# EAGLE design small_mavric (EAGLE 6.2)
DISTRIBUTOR: Mouser

## Sheet 1 of 4
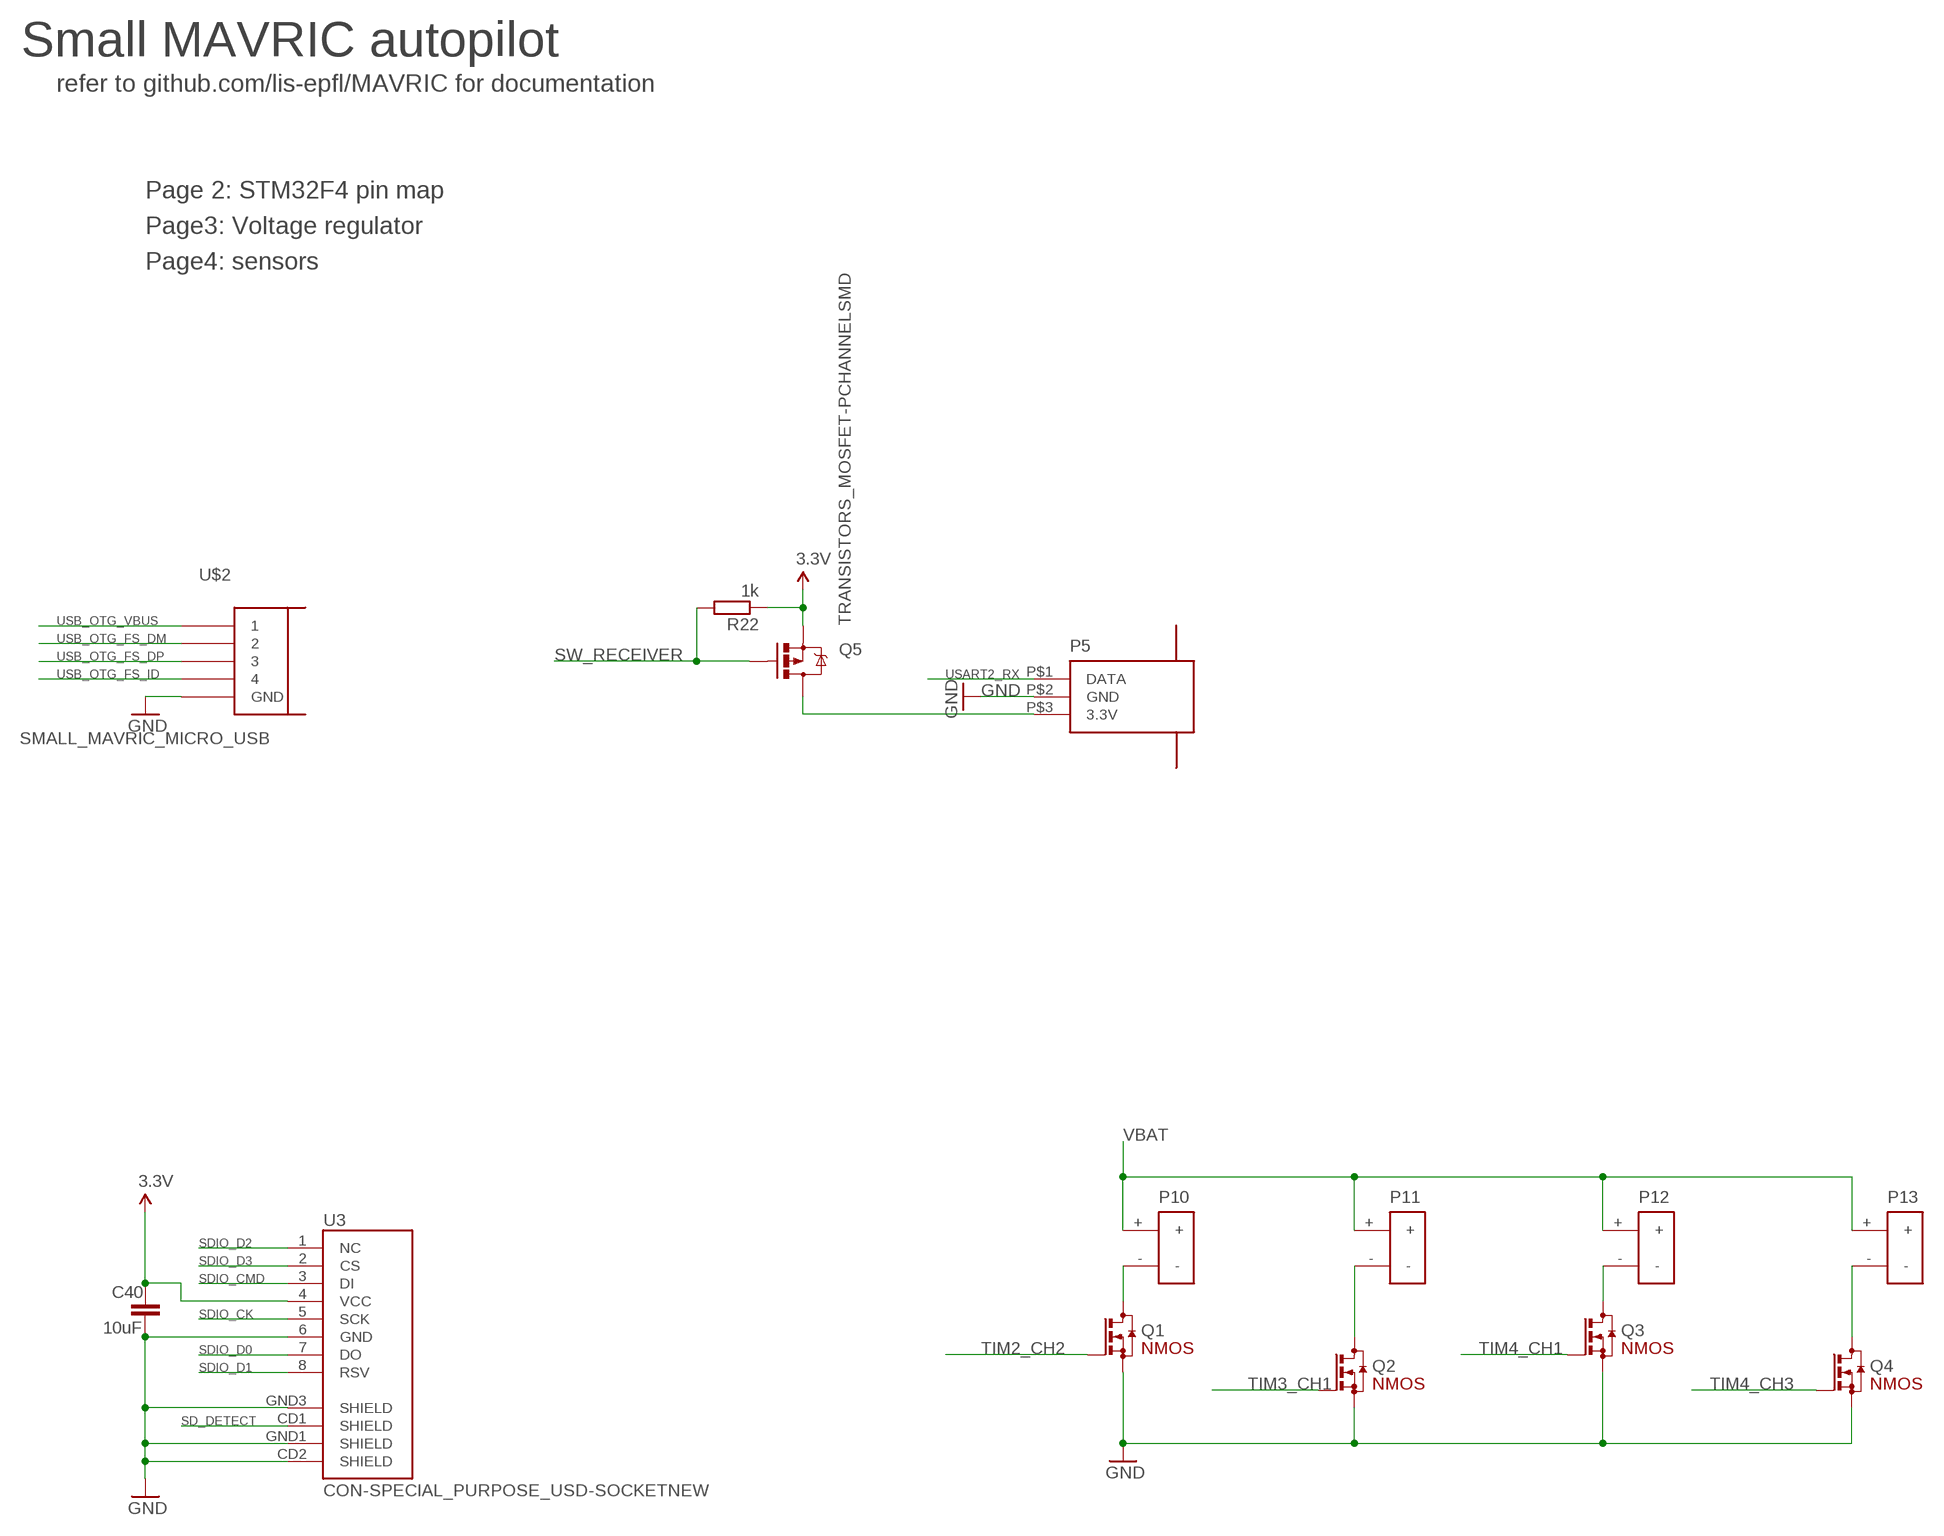
[diagram p0: schematic, sheet 1]

### Parts
C40  10uF  SMALL_MAVRIC_CAPACITOR_C0603  [SMALL_MAVRIC_SMALL_MAVRIC_CAPACITOR_C0603]
P5  CON-SPECIAL_PURPOSE_SPEKTRUM_RECEIVER  [CON-SPECIAL_PURPOSE_JST_1.5MM_3WAY]
P10  POWERSMALL_SMD  [POWER_SMALL_SMD]
P11  POWERSMALL_SMD  [POWER_SMALL_SMD]
P12  POWERSMALL_SMD  [POWER_SMALL_SMD]
P13  POWERSMALL_SMD  [POWER_SMALL_SMD]
Q1  N-CHANNEL_SOT23  [SOT23]
Q2  N-CHANNEL_SOT23  [SOT23]
Q3  N-CHANNEL_SOT23  [SOT23]
Q4  N-CHANNEL_SOT23  [SOT23]
Q5  TRANSISTORS_MOSFET-PCHANNELSMD  [TRANSISTORS_SOT23-3]
R22  1k  SMALL_MAVRIC_RESISTOR_R0402  [SMALL_MAVRIC_SMALL_MAVRIC_RESISTOR_R0402]
U3  CON-SPECIAL_PURPOSE_USD-SOCKETNEW  [CON-SPECIAL_PURPOSE_MICRO-SD-SOCKET-PP]
U$2  SMALL_MAVRIC_MICRO_USB  [SMALL_MAVRIC_MICR0_USB]

### Nets
3.3V [power]: C40.1 Q5.2(S) R22.1 U3.4(VCC) ; also sheet 2,3,4
GND [power]: C40.2 P5.P$2(GND) Q1.2(S) Q2.2(S) Q3.2(S) Q4.2(S) U3.6(GND) U3.CD2(SHIELD) U3.GND1(SHIELD) U3.GND3(SHIELD) U$2.5(GND) ; also sheet 2,3,4
N$10 [power]: P11.- Q2.3(D)
N$12 [power]: P12.- Q3.3(D)
N$22 [power]: P10.- Q1.3(D)
N$26 [power]: P13.- Q4.3(D)
N$34 [more_power]: P5.P$3(3.3V) Q5.3(D)
SD_DETECT: U3.CD1(SHIELD) ; also sheet 2
SDIO_CK: U3.5(SCK) ; also sheet 2
SDIO_CMD: U3.3(DI) ; also sheet 2
SDIO_D0: U3.7(DO) ; also sheet 2
SDIO_D1: U3.8(RSV) ; also sheet 2
SDIO_D2: U3.1(NC) ; also sheet 2
SDIO_D3: U3.2(CS) ; also sheet 2
SW_RECEIVER: Q5.1(G) R22.2 ; also sheet 2
TIM2_CH2: Q1.1(G) ; also sheet 2
TIM3_CH1: Q2.1(G) ; also sheet 2
TIM4_CH1: Q3.1(G) ; also sheet 2
TIM4_CH3: Q4.1(G) ; also sheet 2
USART2_RX: P5.P$1(DATA) ; also sheet 2
USB_OTG_FS_DM: U$2.2 ; also sheet 2
USB_OTG_FS_DP: U$2.3 ; also sheet 2
USB_OTG_FS_ID: U$2.4 ; also sheet 2
USB_OTG_VBUS [power]: U$2.1 ; also sheet 2,3
VBAT [more_power]: P10.+ P11.+ P12.+ P13.+ ; also sheet 3

### Notes on the sheet
- Small MAVRIC autopilot
- refer to github.com/lis-epfl/MAVRIC for documentation
- Page 2: STM32F4 pin map
- Page3: Voltage regulator
- Page4: sensors

## Sheet 2 of 4
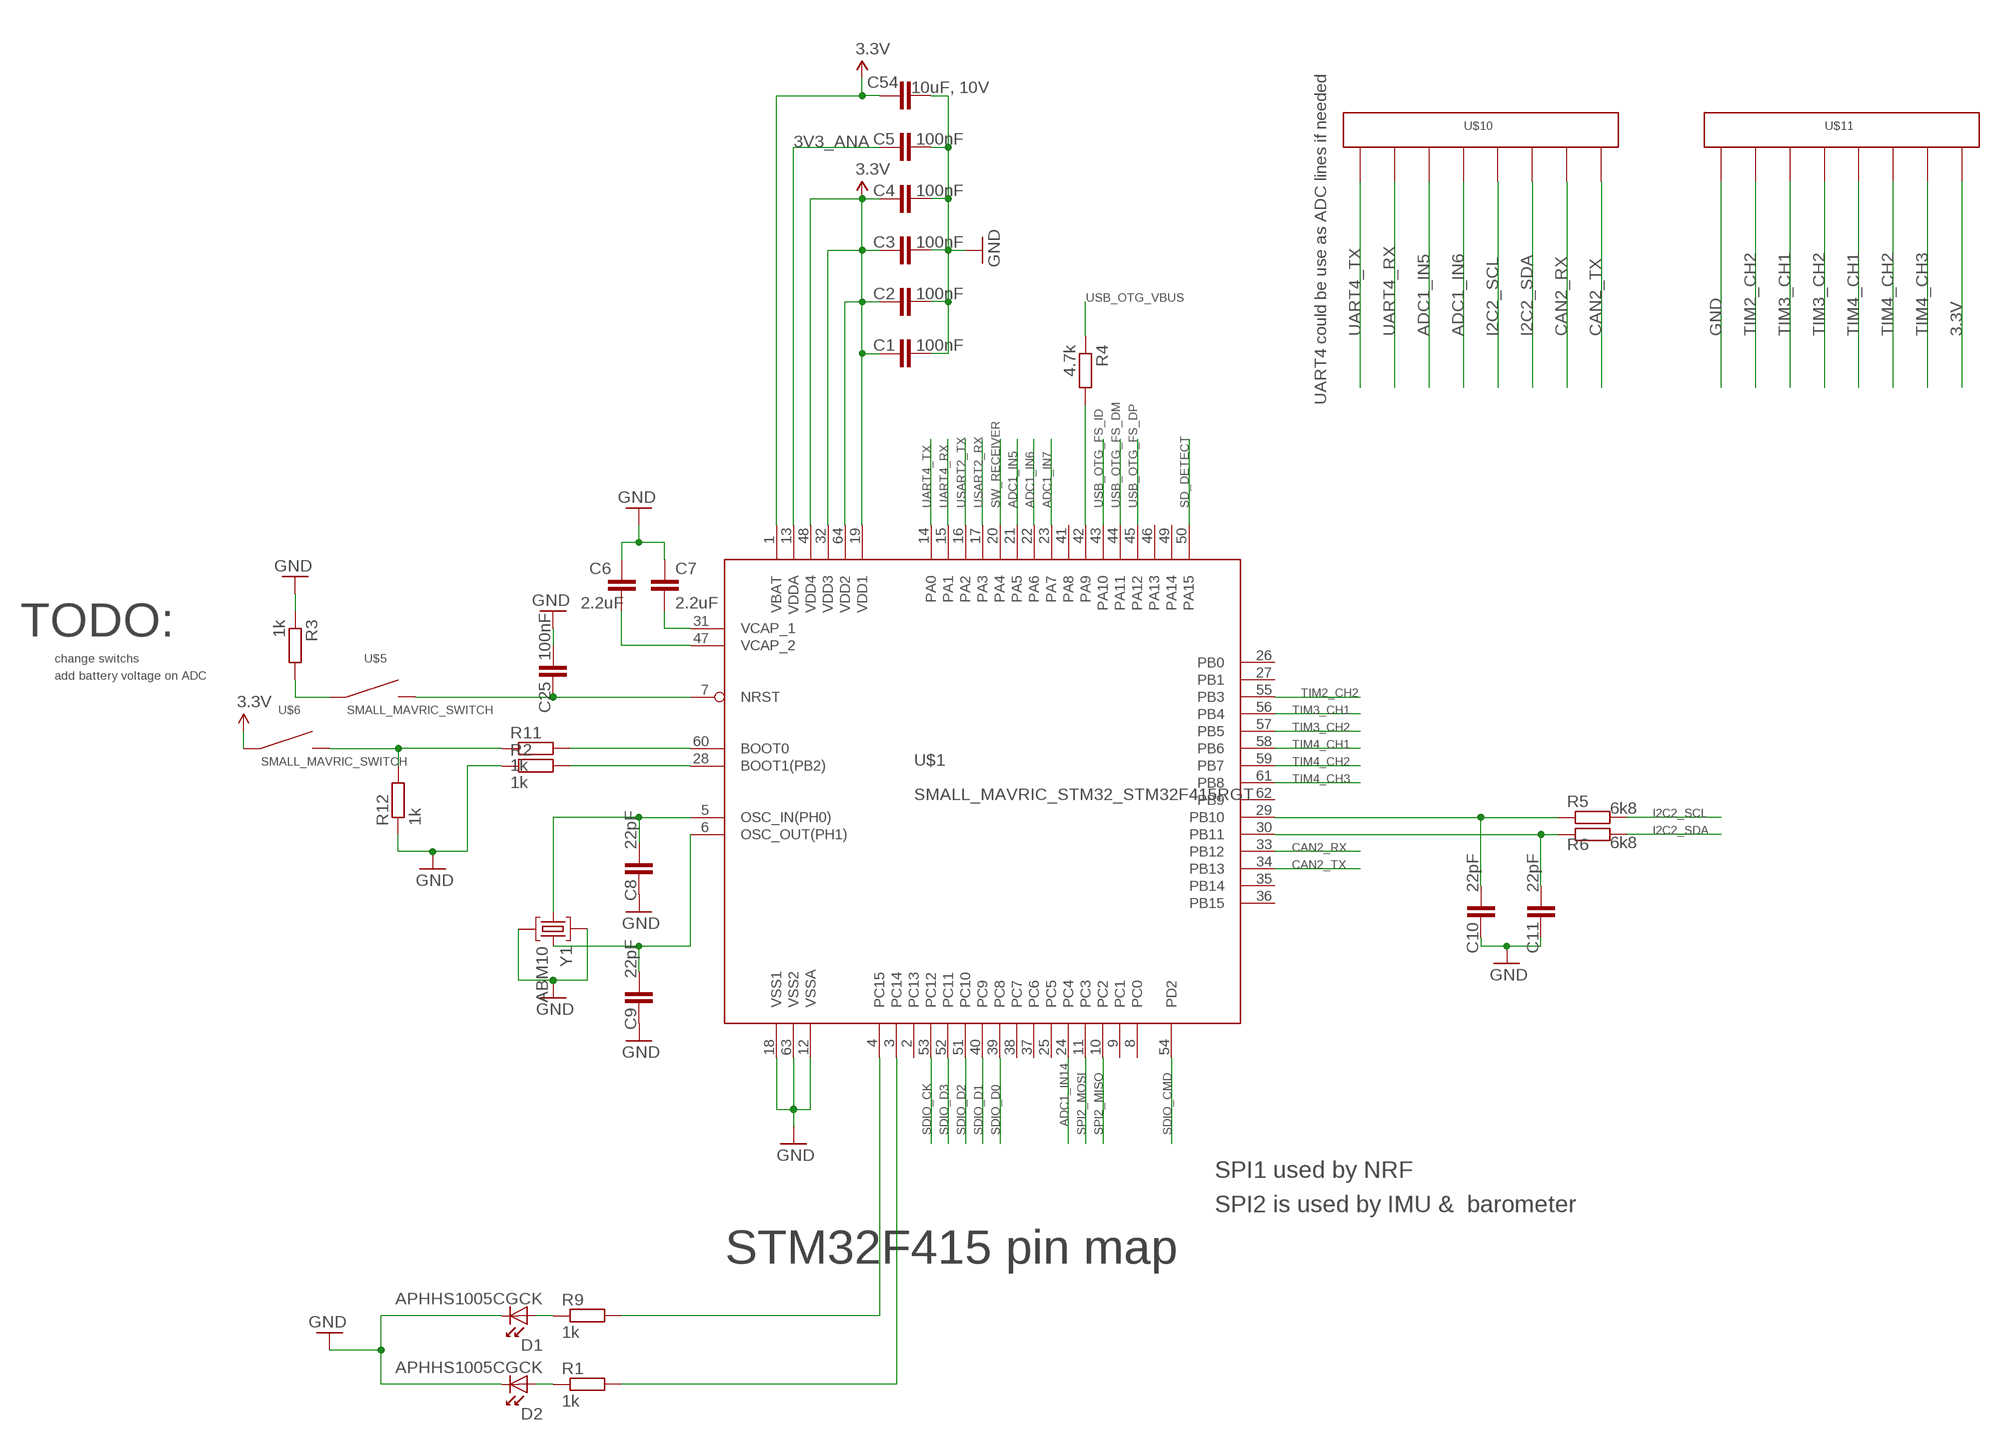
[diagram p1: schematic, sheet 2]

### Parts
C1  100nF  SMALL_MAVRIC_CAPACITOR_C0402  [SMALL_MAVRIC_SMALL_MAVRIC_CAPACITOR_C0402]
C2  100nF  SMALL_MAVRIC_CAPACITOR_C0402  [SMALL_MAVRIC_SMALL_MAVRIC_CAPACITOR_C0402]
C3  100nF  SMALL_MAVRIC_CAPACITOR_C0402  [SMALL_MAVRIC_SMALL_MAVRIC_CAPACITOR_C0402]
C4  100nF  SMALL_MAVRIC_CAPACITOR_C0402  [SMALL_MAVRIC_SMALL_MAVRIC_CAPACITOR_C0402]
C5  100nF  SMALL_MAVRIC_CAPACITOR_C0402  [SMALL_MAVRIC_SMALL_MAVRIC_CAPACITOR_C0402]
C6  2.2uF  SMALL_MAVRIC_CAPACITOR_C0603  [SMALL_MAVRIC_SMALL_MAVRIC_CAPACITOR_C0603]
C7  2.2uF  SMALL_MAVRIC_CAPACITOR_C0603  [SMALL_MAVRIC_SMALL_MAVRIC_CAPACITOR_C0603]
C8  22pF  SMALL_MAVRIC_CAPACITOR_C0402  [SMALL_MAVRIC_SMALL_MAVRIC_CAPACITOR_C0402]
C9  22pF  SMALL_MAVRIC_CAPACITOR_C0402  [SMALL_MAVRIC_SMALL_MAVRIC_CAPACITOR_C0402]
C10  22pF  SMALL_MAVRIC_CAPACITOR_C0402  [SMALL_MAVRIC_SMALL_MAVRIC_CAPACITOR_C0402]
C11  22pF  SMALL_MAVRIC_CAPACITOR_C0402  [SMALL_MAVRIC_SMALL_MAVRIC_CAPACITOR_C0402]
C25  100nF  SMALL_MAVRIC_CAPACITOR_C0402  [SMALL_MAVRIC_SMALL_MAVRIC_CAPACITOR_C0402]
C54  10uF, 10V  SMALL_MAVRIC_CAPACITOR_C0603  [SMALL_MAVRIC_SMALL_MAVRIC_CAPACITOR_C0603]
D1  APHHS1005CGCK  COMMON_LED  [LED_0402]
D2  APHHS1005CGCK  COMMON_LED  [LED_0402]
R1  1k  SMALL_MAVRIC_RESISTOR_R0402  [SMALL_MAVRIC_SMALL_MAVRIC_RESISTOR_R0402]
R2  1k  SMALL_MAVRIC_RESISTOR_R0402  [SMALL_MAVRIC_SMALL_MAVRIC_RESISTOR_R0402]
R3  1k  SMALL_MAVRIC_RESISTOR_R0402  [SMALL_MAVRIC_SMALL_MAVRIC_RESISTOR_R0402]
R4  4.7k  SMALL_MAVRIC_RESISTOR_R0402  [SMALL_MAVRIC_SMALL_MAVRIC_RESISTOR_R0402]
R5  6k8  SMALL_MAVRIC_RESISTOR_R0402  [SMALL_MAVRIC_SMALL_MAVRIC_RESISTOR_R0402]
R6  6k8  SMALL_MAVRIC_RESISTOR_R0402  [SMALL_MAVRIC_SMALL_MAVRIC_RESISTOR_R0402]
R9  1k  SMALL_MAVRIC_RESISTOR_R0402  [SMALL_MAVRIC_SMALL_MAVRIC_RESISTOR_R0402]
R11  1k  SMALL_MAVRIC_RESISTOR_R0402  [SMALL_MAVRIC_SMALL_MAVRIC_RESISTOR_R0402]
R12  1k  SMALL_MAVRIC_RESISTOR_R0402  [SMALL_MAVRIC_SMALL_MAVRIC_RESISTOR_R0402]
U$1  SMALL_MAVRIC_STM32_STM32F415RGT  [SMALL_MAVRIC_STM32_LQFP64]
U$5  SMALL_MAVRIC_SWITCH  [SMALL_MAVRIC_SWITCH]
U$6  SMALL_MAVRIC_SWITCH  [SMALL_MAVRIC_SWITCH]
U$10  SMALL_MAVRIC_CONN_RAIL_X8  [SMALL_MAVRIC_CONN_RAIL_X8]
U$11  SMALL_MAVRIC_CONN_RAIL_X8  [SMALL_MAVRIC_CONN_RAIL_X8]
Y1  ABM10  [OSCILLATOR_ABM10]

### Nets
3.3V [power]: C1.1 C2.1 C3.1 C4.1 C54.1 U$1.1(VBAT) U$1.19(VDD1) U$1.32(VDD3) U$1.48(VDD4) U$1.64(VDD2) U$6.1 U$11.P$8 ; also sheet 1,3,4
3V3_ANA: C5.1 U$1.13(VDDA) ; also sheet 3,4
ADC1_IN5: U$1.21(PA5) U$10.P$3
ADC1_IN6: U$1.22(PA6) U$10.P$4
ADC1_IN7: U$1.23(PA7)
ADC1_IN14: U$1.24(PC4)
CAN2_RX: U$1.33(PB12) U$10.P$7
CAN2_TX: U$1.34(PB13) U$10.P$8
GND [power]: C1.2 C2.2 C3.2 C4.2 C5.2 C6.1 C7.1 C8.1 C9.1 C10.1 C11.1 C25.2 C54.2 D1.C D2.C R2.1 R3.1 R12.1 U$1.12(VSSA) U$1.18(VSS1) U$1.63(VSS2) U$11.P$1 Y1.2 Y1.4 ; also sheet 1,3,4
I2C2_SCL: R5.2 U$10.P$5 ; also sheet 4
I2C2_SD: C11.2 R6.1 U$1.30(PB11)
I2C2_SDA: R6.2 U$10.P$6 ; also sheet 4
N$1: D2.A R1.1
N$3: C8.2 U$1.5(OSC_IN(PH0)) Y1.1
N$4: R2.2 U$1.28(BOOT1(PB2))
N$5: C7.2 U$1.31(VCAP_1)
N$6: C6.2 U$1.47(VCAP_2)
N$7: C9.2 U$1.6(OSC_OUT(PH1)) Y1.3
N$8: R4.2 U$1.42(PA9)
N$9: R3.2 U$5.1
N$13: D1.A R9.1
N$17 [power]: R1.2 U$1.3(PC14)
N$24 [power]: R9.2 U$1.4(PC15)
N$25: C25.1 U$1.7(NRST) U$5.2
N$27: R11.2 U$1.60(BOOT0)
N$28: C10.2 R5.1 U$1.29(PB10)
N$29: R11.1 R12.2 U$6.2
SD_DETECT: U$1.50(PA15) ; also sheet 1
SDIO_CK: U$1.53(PC12) ; also sheet 1
SDIO_CMD: U$1.54(PD2) ; also sheet 1
SDIO_D0: U$1.39(PC8) ; also sheet 1
SDIO_D1: U$1.40(PC9) ; also sheet 1
SDIO_D2: U$1.51(PC10) ; also sheet 1
SDIO_D3: U$1.52(PC11) ; also sheet 1
SPI2_MISO: U$1.10(PC2)
SPI2_MOSI: U$1.11(PC3)
SW_RECEIVER: U$1.20(PA4) ; also sheet 1
TIM2_CH2: U$1.55(PB3) U$11.P$2 ; also sheet 1
TIM3_CH1: U$1.56(PB4) U$11.P$3 ; also sheet 1
TIM3_CH2: U$1.57(PB5) U$11.P$4
TIM4_CH1: U$1.58(PB6) U$11.P$5 ; also sheet 1
TIM4_CH2: U$1.59(PB7) U$11.P$6
TIM4_CH3: U$1.61(PB8) U$11.P$7 ; also sheet 1
UART4_RX: U$1.15(PA1) U$10.P$2
UART4_TX: U$1.14(PA0) U$10.P$1
USART2_RX: U$1.17(PA3) ; also sheet 1
USART2_TX: U$1.16(PA2)
USB_OTG_FS_DM: U$1.44(PA11) ; also sheet 1
USB_OTG_FS_DP: U$1.45(PA12) ; also sheet 1
USB_OTG_FS_ID: U$1.43(PA10) ; also sheet 1
USB_OTG_VBUS [power]: R4.1 ; also sheet 1,3
Unconnected: U$1.2(PC13) U$1.8(PC0) U$1.9(PC1) U$1.25(PC5) U$1.26(PB0) U$1.27(PB1) U$1.35(PB14) U$1.36(PB15) U$1.37(PC6) U$1.38(PC7) U$1.41(PA8) U$1.46(PA13) U$1.49(PA14) U$1.62(PB9)

### Notes on the sheet
- UART4 could be use as ADC lines if needed
- TODO:
- change switchs
- add battery voltage on ADC
- SPI1 used by NRF
- SPI2 is used by IMU &  barometer
- STM32F415 pin map

## Sheet 3 of 4
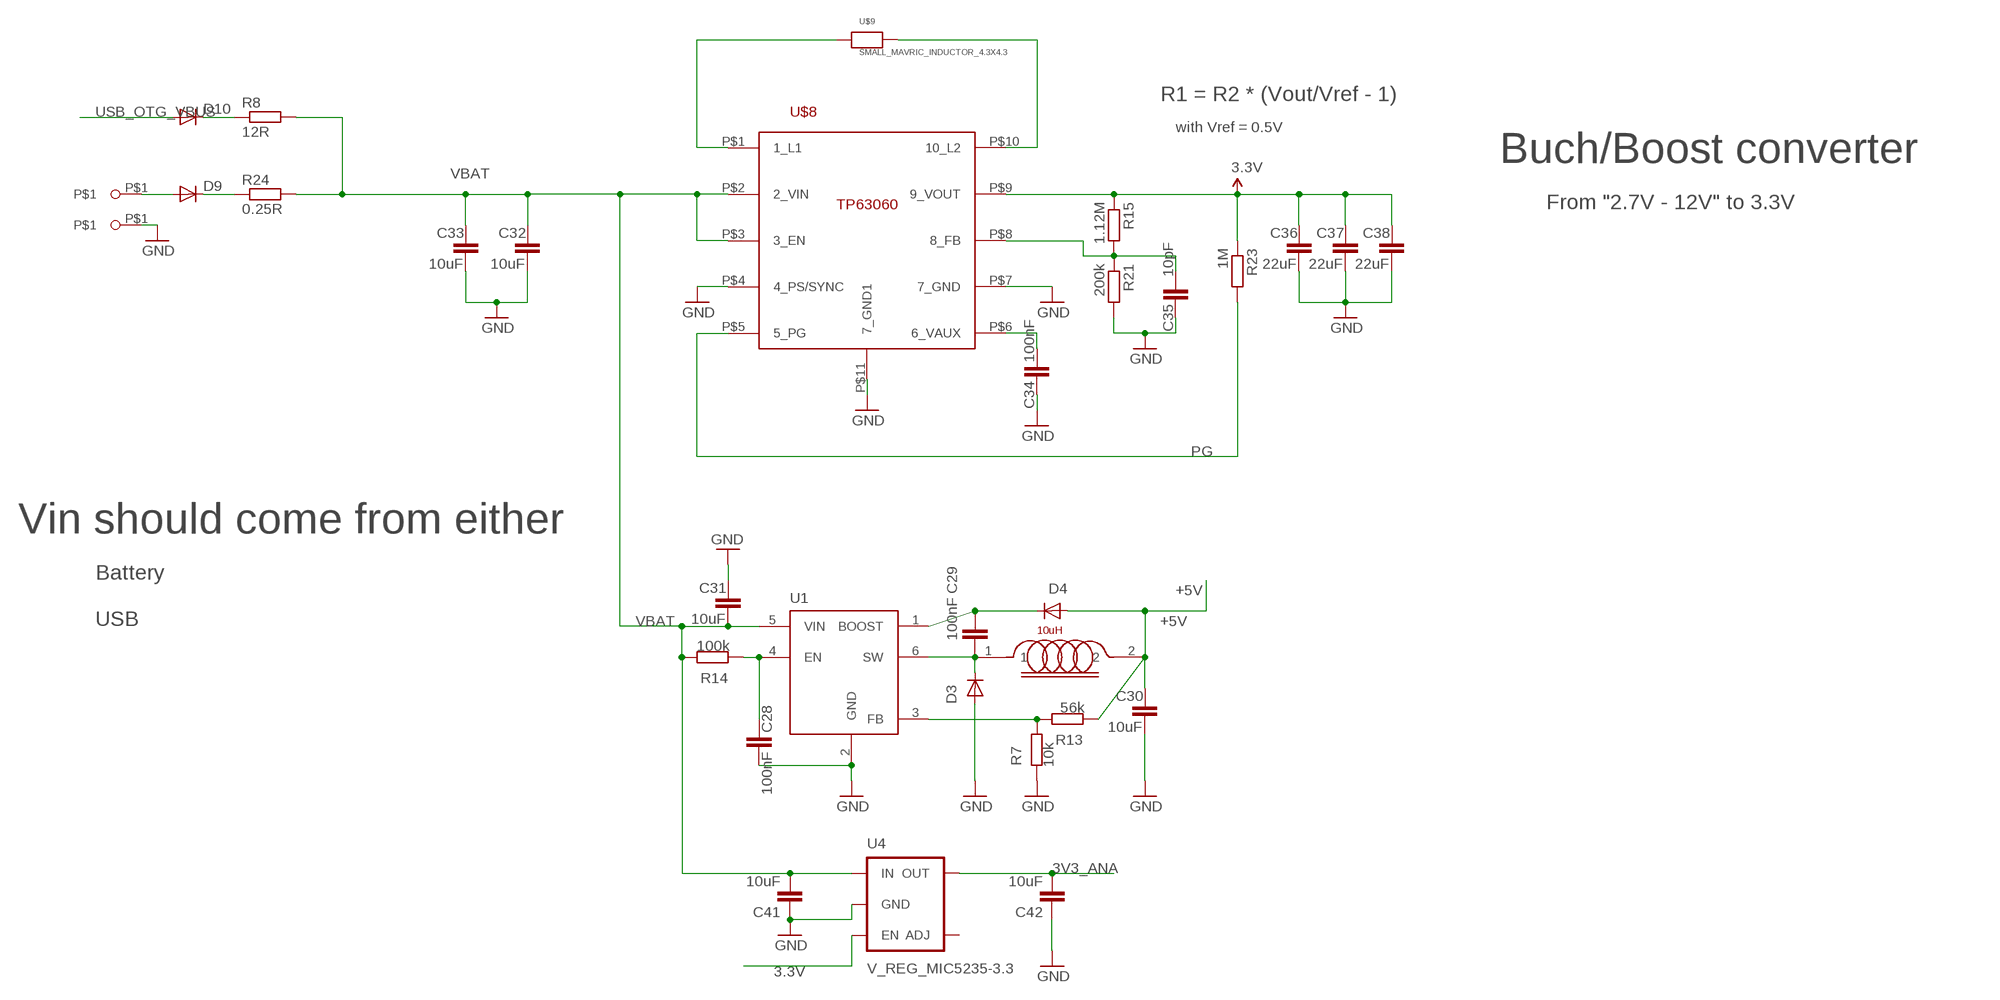
[diagram p2: schematic, sheet 3]

### Parts
C28  100nF  SMALL_MAVRIC_CAPACITOR_C0402  [SMALL_MAVRIC_SMALL_MAVRIC_CAPACITOR_C0402]
C29  100nF  SMALL_MAVRIC_CAPACITOR_C0402  [SMALL_MAVRIC_SMALL_MAVRIC_CAPACITOR_C0402]
C30  10uF  SMALL_MAVRIC_CAPACITOR_C0603  [SMALL_MAVRIC_SMALL_MAVRIC_CAPACITOR_C0603]
C31  10uF  SMALL_MAVRIC_CAPACITOR_C0603  [SMALL_MAVRIC_SMALL_MAVRIC_CAPACITOR_C0603]
C32  10uF  SMALL_MAVRIC_CAPACITOR_C0603  [SMALL_MAVRIC_SMALL_MAVRIC_CAPACITOR_C0603]
C33  10uF  SMALL_MAVRIC_CAPACITOR_C0603  [SMALL_MAVRIC_SMALL_MAVRIC_CAPACITOR_C0603]
C34  100nF  SMALL_MAVRIC_CAPACITOR_C0402  [SMALL_MAVRIC_SMALL_MAVRIC_CAPACITOR_C0402]
C35  10pF  SMALL_MAVRIC_CAPACITOR_C0402  [SMALL_MAVRIC_SMALL_MAVRIC_CAPACITOR_C0402]
C36  22uF  SMALL_MAVRIC_CAPACITOR_C0603  [SMALL_MAVRIC_SMALL_MAVRIC_CAPACITOR_C0603]
C37  22uF  SMALL_MAVRIC_CAPACITOR_C0603  [SMALL_MAVRIC_SMALL_MAVRIC_CAPACITOR_C0603]
C38  22uF  SMALL_MAVRIC_CAPACITOR_C0603  [SMALL_MAVRIC_SMALL_MAVRIC_CAPACITOR_C0603]
C41  10uF  C-EUC0805  [C0805]
C42  10uF  C-EUC0805  [C0805]
D3  SMALL_MAVRIC_POWER_DIODESOD  [SMALL_MAVRIC_POWER_SOD-323]
D4  SMALL_MAVRIC_POWER_DIODESOD  [SMALL_MAVRIC_POWER_SOD-323]
D9  SMALL_MAVRIC_POWER_DIODESOD  [SMALL_MAVRIC_POWER_SOD-323]
D10  SMALL_MAVRIC_POWER_DIODESOD  [SMALL_MAVRIC_POWER_SOD-323]
L1  10uH  POWER_INDUCTOR1210  [POWER_C1210]
R7  10k  SMALL_MAVRIC_RESISTOR_R0402  [SMALL_MAVRIC_SMALL_MAVRIC_RESISTOR_R0402]
R8  12R  SMALL_MAVRIC_RESISTOR_R0402  [SMALL_MAVRIC_SMALL_MAVRIC_RESISTOR_R0402]
R13  56k  SMALL_MAVRIC_RESISTOR_R0402  [SMALL_MAVRIC_SMALL_MAVRIC_RESISTOR_R0402]
R14  100k  SMALL_MAVRIC_RESISTOR_R0402  [SMALL_MAVRIC_SMALL_MAVRIC_RESISTOR_R0402]
R15  1.12M  SMALL_MAVRIC_RESISTOR_R0402  [SMALL_MAVRIC_SMALL_MAVRIC_RESISTOR_R0402]
R21  200k  SMALL_MAVRIC_RESISTOR_R0402  [SMALL_MAVRIC_SMALL_MAVRIC_RESISTOR_R0402]
R23  1M  SMALL_MAVRIC_RESISTOR_R0402  [SMALL_MAVRIC_SMALL_MAVRIC_RESISTOR_R0402]
R24  0.25R  SMALL_MAVRIC_RESISTOR_R0402  [SMALL_MAVRIC_SMALL_MAVRIC_RESISTOR_R0402]
U1  POWER_LM2734  [POWER_SOT23-6]
U4  V_REG_MIC5235-3.3  V_REG_MIC5235  [SOT23-5]
U$8  SMALL_MAVRIC_POWER_TPS63060  [SMALL_MAVRIC_POWER_PWSON]
U$9  SMALL_MAVRIC_INDUCTOR_4.3X4.3  [SMALL_MAVRIC_SMALL_MAVRIC_SMALL_MAVRIC_INDUCTOR_4.3X4.3]
U$15  SMALL_MAVRIC_SMALL_CONNECTOR  [SMALL_MAVRIC_SMALL_CONN]
U$16  SMALL_MAVRIC_SMALL_CONNECTOR  [SMALL_MAVRIC_SMALL_CONN]

### Nets
3.3V [power]: C36.1 C37.1 C38.1 R15.1 R23.1 U4.3(EN) U$8.P$9(9_VOUT) ; also sheet 1,2,4
3V3_ANA: C42.2 U4.5(OUT) ; also sheet 2,4
6V_ENABLE1: C28.1 R14.1 U1.4(EN)
+5V [power]: C30.1 D4.2(A) L1.2 R13.1
GND [power]: C28.2 C30.2 C31.1 C32.2 C33.2 C34.1 C35.1 C36.2 C37.2 C38.2 C41.1 C42.1 D3.2(A) R7.1 R21.2 U1.2(GND) U4.2(GND) U$8.P$4(4_PS/SYNC) U$8.P$7(7_GND) U$8.P$11(7_GND1) U$15.P$1 ; also sheet 1,2,4
N$2: D10.1(C) R8.1
N$11 [more_power]: C29.2 D3.1(C) L1.1 U1.6(SW)
N$14 [power]: R7.2 R13.2 U1.3(FB)
N$15: C29.1 D4.1(C) U1.1(BOOST)
N$16: U$8.P$1(1_L1) U$9.P$1
N$18: U$8.P$10(10_L2) U$9.P$2
N$19: C34.2 U$8.P$6(6_VAUX)
N$31: C35.2 R15.2 R21.1 U$8.P$8(8_FB)
N$32 [more_power]: D9.2(A) U$16.P$1
N$33: D9.1(C) R24.1
PG: R23.2 U$8.P$5(5_PG)
USB_OTG_VBUS [power]: D10.2(A) ; also sheet 1,2
VBAT [more_power]: C31.2 C32.1 C33.1 C41.2 R8.2 R14.2 R24.2 U1.5(VIN) U4.1(IN) U$8.P$2(2_VIN) U$8.P$3(3_EN) ; also sheet 1
Unconnected: U4.4(ADJ)

### Notes on the sheet
- R1 = R2 * (Vout/Vref - 1)
- with Vref = 0.5V
- Buch/Boost converter
- From "2.7V - 12V" to 3.3V
- Vin should come from either
- Battery
- USB

## Sheet 4 of 4
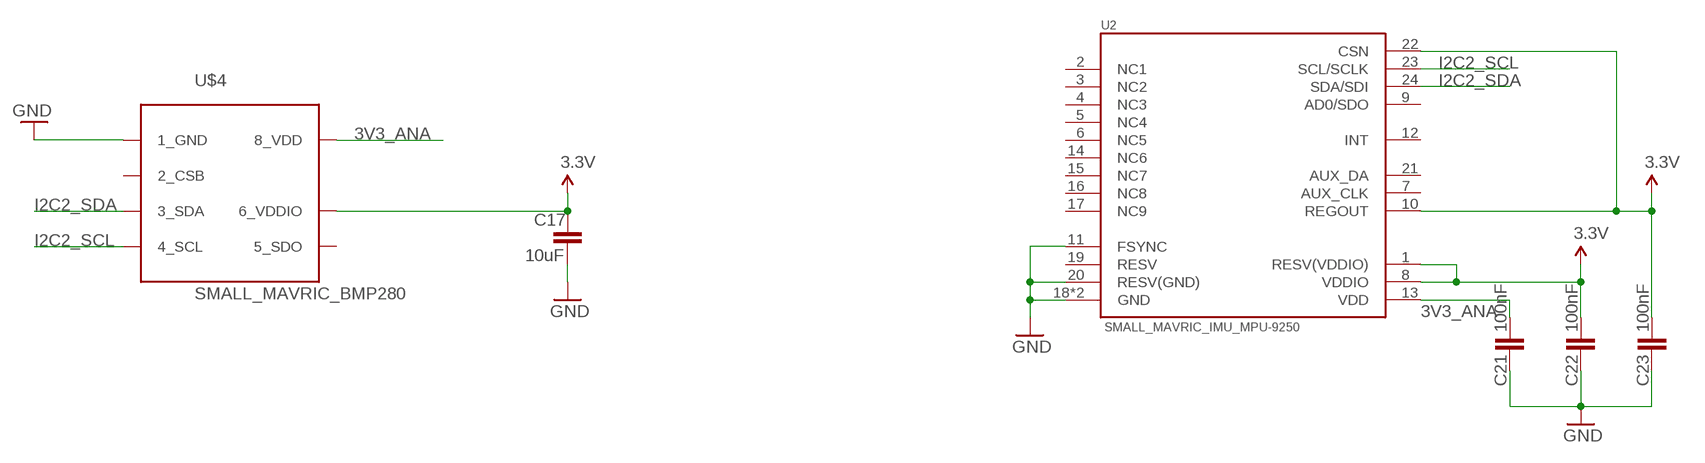
[diagram p3: schematic, sheet 4]

### Parts
C17  10uF  SMALL_MAVRIC_CAPACITOR_C0603  [SMALL_MAVRIC_SMALL_MAVRIC_CAPACITOR_C0603]
C21  100nF  SMALL_MAVRIC_CAPACITOR_C0402  [SMALL_MAVRIC_SMALL_MAVRIC_CAPACITOR_C0402]
C22  100nF  SMALL_MAVRIC_CAPACITOR_C0402  [SMALL_MAVRIC_SMALL_MAVRIC_CAPACITOR_C0402]
C23  100nF  SMALL_MAVRIC_CAPACITOR_C0402  [SMALL_MAVRIC_SMALL_MAVRIC_CAPACITOR_C0402]
U2  SMALL_MAVRIC_IMU_MPU-9250  [SMALL_MAVRIC_SMALL_MAVRIC_QFN-24_3.0X3.0MM]
U$4  SMALL_MAVRIC_BMP280  [SMALL_MAVRIC_SMALL_MAVRIC_SMALL_MAVRIC_LGA-8]

### Nets
3.3V [power]: C17.1 C22.2 C23.2 U2.1(RESV(VDDIO)) U2.8(VDDIO) U2.10(REGOUT) U2.22(CSN) U$4.P$6(6_VDDIO) ; also sheet 1,2,3
3V3_ANA: C21.2 U2.13(VDD) U$4.P$8(8_VDD) ; also sheet 2,3
GND [power]: C17.2 C21.1 C22.1 C23.1 U2.11(FSYNC) U2.18(GND) U2.20(RESV(GND)) U2.CENTRAL_PAD(GND) U$4.P$1(1_GND) U$4.P$7(1_GND) ; also sheet 1,2,3
I2C2_SCL: U2.23(SCL/SCLK) U$4.P$4(4_SCL) ; also sheet 2
I2C2_SDA: U2.24(SDA/SDI) U$4.P$3(3_SDA) ; also sheet 2
Unconnected: U2.2(NC1) U2.3(NC2) U2.4(NC3) U2.5(NC4) U2.6(NC5) U2.7(AUX_CLK) U2.9(AD0/SDO) U2.12(INT) U2.14(NC6) U2.15(NC7) U2.16(NC8) U2.17(NC9) U2.19(RESV) U2.21(AUX_DA) U$4.P$2(2_CSB) U$4.P$5(5_SDO)

## Library data of the parts
C1-C5 C8-C11 C21-C23 C25 C28 C29 C34 C35 = small_mavric:SMALL_MAVRIC_CAPACITOR_; PARTNO: *; PLACE_PART: YES
C6 C7 C17 C30-C33 C36-C38 C40 = small_mavric:SMALL_MAVRIC_CAPACITOR_; PARTNO: 2.2UF 16V 0603; PLACE_PART: YES
C41 C42 = rcl:C-EU: CAPACITOR, European symbol; PLACE_PART: YES
C54 = small_mavric:SMALL_MAVRIC_CAPACITOR_; PARTNO: 10UF 10V 0805; PLACE_PART: YES
D1 D2 = small_mavric:COMMON_LED; PARTNO: APHHS1005CGCK
D3 D4 D9 D10 = small_mavric:SMALL_MAVRIC_POWER_DIODE: Diode These are standard reverse protection diodes and small signal diodes. SMA package can handle up to about 1A. SOD-323 can handle about 200mA. What the SOD-323 package when ordering, there are some mfgs out there that are 5-pin packages.; DISTRIBUTOR: Digikey; ORDER_CODE: 568-4128-1-ND; PLACE_PART: YES
L1 = small_mavric:POWER_INDUCTOR; DISTRIBUTOR: Digikey; ORDER_CODE: 445-4847-1-ND; PLACE_PART: YES
P5 = small_mavric:CON-SPECIAL_PURPOSE_SPEKTRUM_RECEIVER; DISTRIBUTOR: Digikey; ORDER_CODE: 455-1658-ND; PLACE_PART: YES; UNIT_PRICE: 0.14; UNIT_PRICE_100X: 0.0895; UNIT_PRICE_10X: 0.129; UNIT_PRICE_25X: 0.129; UNIT_PRICE_50X: 0.0962
P10-P13 = con-special_purpose:POWER; PLACE_PART: NO
Q1-Q4 = transistors:N-CHANNEL_SOT23: N-CHANNEL MOS FET; DISTRIBUTOR: Digikey; ORDER_CODE: IRLML6244TRPBFCT-ND; PLACE_PART: YES
Q5 = small_mavric:TRANSISTORS_MOSFET-PCHANNEL; DISTRIBUTOR: Digikey; ORDER_CODE: SSM3J328RLF(TCT-ND; PLACE_PART: YES; UNIT_PRICE: 0.38; UNIT_PRICE_100X: 0.1756; UNIT_PRICE_10X: 0.267; UNIT_PRICE_25X: 0.2196; UNIT_PRICE_50X: 0.2196
R1-R9 R11-R15 R21 R23 R24 = small_mavric:SMALL_MAVRIC_RESISTOR_; PARTNO: *; PLACE_PART: YES
R22 = small_mavric:SMALL_MAVRIC_RESISTOR_; PLACE_PART: YES
U1 = small_mavric:POWER_LM2734; DISTRIBUTOR: Digikey; ORDER_CODE: LM2734ZMK/NOPBCT-ND; PLACE_PART: YES
U2 = small_mavric:SMALL_MAVRIC_IMU_MPU-9250; DISTRIBUTOR: digikey; ORDER_CODE: 1428-1019-1-ND; PLACE_PART: YES
U3 = small_mavric:CON-SPECIAL_PURPOSE_USD-SOCKET: microSD Socket Push-push type uSD socket. Schematic element and footprint production proven. Spark Fun Electronics SKU : PRT-00127. tDoc lines correctly indicate media card edge positions when inserting (unlocked, locked, depressed).; DISTRIBUTOR: Mouser; ORDER_CODE: 517-2908-05WB-MG; PLACE_PART: YES; UNIT_PRICE: 1.94; UNIT_PRICE_100X: 1.42; UNIT_PRICE_10X: 1.94; UNIT_PRICE_25X: 1.74; UNIT_PRICE_50X: 1.6
U4 = power:V_REG_MIC5235; DISTRIBUTOR: Digikey; ORDER_CODE: 576-2784-1-ND; PLACE_PART: YES
U$1 = small_mavric:SMALL_MAVRIC_STM32_STM32F415RGT; DISTRIBUTOR: mouser; ORDER_CODE: 511-STM32F415RGT6; PLACE_PART: YES
U$2 = small_mavric:SMALL_MAVRIC_MICRO_USB; DISTRIBUTOR: mouser; ORDER_CODE: 538-47589-0001; PLACE_PART: YES
U$4 = small_mavric:SMALL_MAVRIC_BMP280; DISTRIBUTOR: mouser; ORDER_CODE: 262-BMP280; PLACE_PART: YES
U$5 U$6 = small_mavric:SMALL_MAVRIC_SWITCH; DISTRIBUTOR: digikey; ORDER_CODE: SW1022CT-ND; PLACE_PART: YES
U$8 = small_mavric:SMALL_MAVRIC_POWER_TPS63060; DISTRIBUTOR: mouser; ORDER_CODE: 595-TPS63060DSCT; PLACE_PART: YES
U$9 = small_mavric:SMALL_MAVRIC_INDUCTOR_4.3X4.3; DISTRIBUTOR: mouser; ORDER_CODE: 994-XFL4020-102MEC; PLACE_PART: YES
U$10 U$11 = small_mavric:SMALL_MAVRIC_CONN_RAIL_X8
U$15 U$16 = small_mavric:SMALL_MAVRIC_SMALL_CONNECTOR; DISTRIBUTOR: Mouser; PLACE_PART: YES
Y1 = small_mavric:ABM10; DISTRIBUTOR: mouser; MF_NUM: 815-ABM10-25-E20-T; PARTNO: ABM10 25MHz

## Net classes
0 default: width 0.15 mm, drill 0.2 mm, clearance 0.15 mm
1 power: width 0.2 mm, drill 0.2 mm, clearance 0.15 mm
2 more_power: width 0.4 mm, drill 0.3 mm, clearance 0.15 mm

## Board
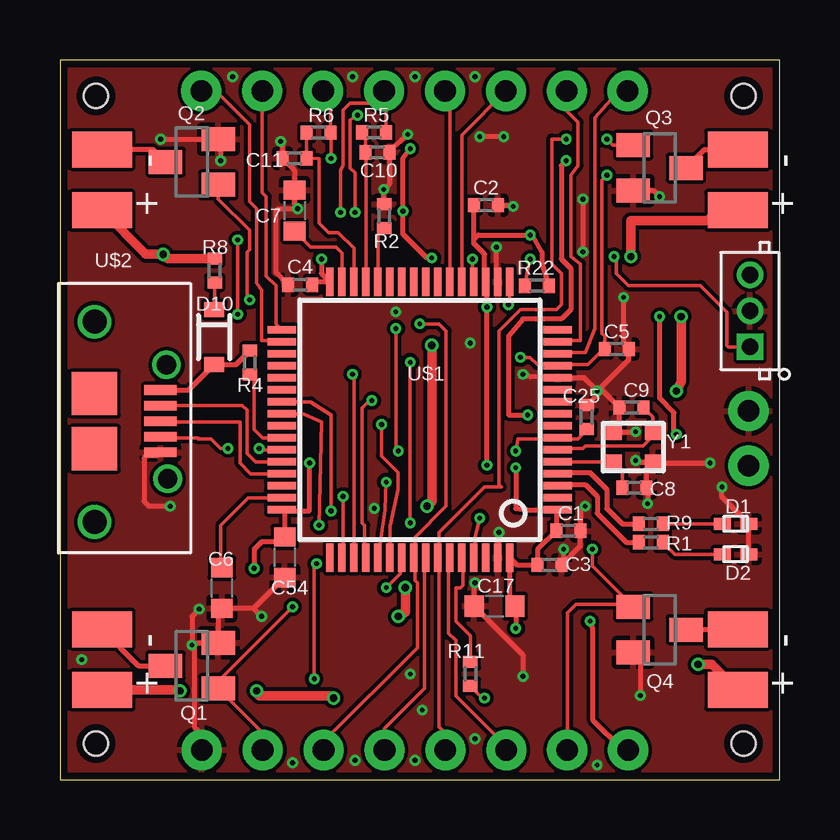
[diagram p4: board, top side]
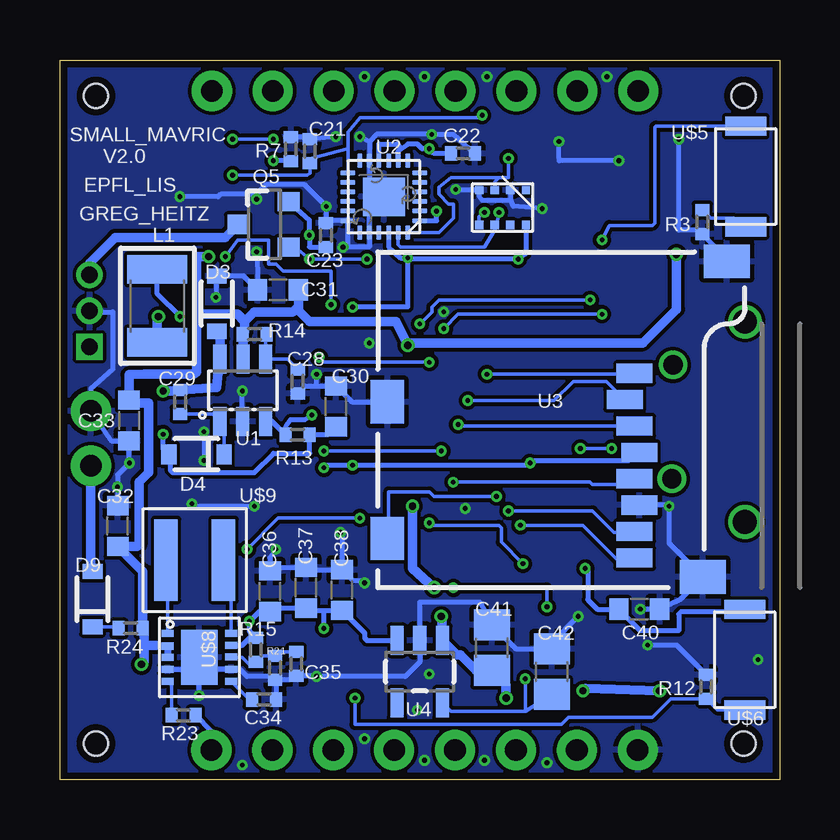
[diagram p5: board, bottom side, seen from below]

Size 30 x 30 mm. Coordinates in mm from the lower left corner, seen from the top.
Outline: 0,0 30,0 30,30 0,30 0,0
Copper layers (1*16): Top 0.035mm / dielectric 1.5mm / Bottom 0.035mm
Design rules: minimum track width 0.125mm, minimum drill 0.2mm, track to track 0.125mm, track to pad 0.125mm, pad to pad 0.125mm, via to via 0.125mm, smd to smd 0.125mm, copper to edge 0.3mm, drill to drill 0.2mm, minimum pad ring 0.2mm, minimum via ring 0.125mm, stop-mask expansion 0.075mm, vias tented up to drill 0mil, thermal gap 0.2mm
Holes 1 mm at 1.5,28.5 28.5,28.5 28.5,1.5 1.5,1.5

### Footprints (pad centres in the part's own frame; a part is rotated, then mirrored left to right if it is on the bottom)
SMALL_MAVRIC_SMALL_MAVRIC_CAPACITOR_C0402 = smd 0.5 x 0.6: 1 -0.5,0; 2 0.5,0
SMALL_MAVRIC_SMALL_MAVRIC_CAPACITOR_C0603 = smd 0.8 x 0.9: 1 -0.85,0; 2 0.85,0
C0805 = smd 1.3 x 1.5: 1 -0.95,0; 2 0.95,0
LED_0402 = smd 0.7 x 0.5: A -3.09,0; C -1.99,0
SMALL_MAVRIC_POWER_SOD-323 = smd 0.63 x 0.83: 1 -1.15,0; 2 1.15,0
POWER_C1210 = smd 1.2 x 2.5: 1 -1.524,0; 2 1.524,0
CON-SPECIAL_PURPOSE_JST_1.5MM_3WAY = drill 0.7 square: P$1 0,1.5 | drill 0.7: P$2 0,0; P$3 0,-1.5
POWER_SMALL_SMD = smd 1.5 x 2.5: + -1.27,0; - 1.27,0
SOT23 = smd 1 x 1.4: 1 -0.95,-1.1; 2 0.95,-1.1; 3 0,1.1
TRANSISTORS_SOT23-3 = smd 0.8 x 0.9: 1 -0.95,-1; 2 0.95,-1; 3 0,1.1
SMALL_MAVRIC_SMALL_MAVRIC_RESISTOR_R0402 = smd 0.5 x 0.6: 1 -0.5,0; 2 0.5,0
POWER_SOT23-6 = smd 0.55 x 1.2: 1 -0.95,-1.3; 2 0,-1.3; 3 0.95,-1.3; 4 0.95,1.3; 5 0.015,1.3; 6 -0.95,1.3
SMALL_MAVRIC_SMALL_MAVRIC_QFN-24_3.0X3.0MM = smd 0.6 x 0.2: 1 -1.5,1; 2 -1.5,0.6; 3 -1.5,0.2; 4 -1.5,-0.2; 5 -1.5,-0.6; 6 -1.5,-1; 13 1.5,-1; 14 1.5,-0.6; 15 1.5,-0.2; 16 1.5,0.2; 17 1.5,0.6; 18 1.5,1 | smd 0.2 x 0.6: 7 -1,-1.5; 8 -0.6,-1.5; 9 -0.2,-1.5; 10 0.2,-1.5; 11 0.6,-1.5; 12 1,-1.5; 19 1,1.5; 20 0.6,1.5; 21 0.2,1.5; 22 -0.2,1.5; 23 -0.6,1.5; 24 -1,1.5 | smd 1.75 x 1.6: CENTRAL_PAD 0,0
CON-SPECIAL_PURPOSE_MICRO-SD-SOCKET-PP = smd 0.8 x 1.5: 1 -8.94,10.7; 2 -7.84,10.3; 3 -6.74,10.7; 4 -5.64,10.9; 5 -4.54,10.7; 6 -3.44,10.9; 7 -2.34,10.7; 8 -1.24,10.7 | smd 1.8 x 1.4: CD1 -2.05,0.4; CD2 -7.75,0.4 | smd 1.4 x 1.9: GND1 -13.6,14.55; GND3 -0.45,13.55
SOT23-5 = smd 0.55 x 1.2: 1 -0.95,-1.3; 2 0,-1.3; 3 0.95,-1.3; 4 0.95,1.3; 5 -0.95,1.3
SMALL_MAVRIC_STM32_LQFP64 = smd 0.3 x 1.2: 1 -3.75,-5.75; 2 -3.25,-5.75; 3 -2.75,-5.75; 4 -2.25,-5.75; 5 -1.75,-5.75; 6 -1.25,-5.75; 7 -0.75,-5.75; 8 -0.25,-5.75; 9 0.25,-5.75; 10 0.75,-5.75; 11 1.25,-5.75; 12 1.75,-5.75; 13 2.25,-5.75; 14 2.75,-5.75; 15 3.25,-5.75; 16 3.75,-5.75; 33 3.75,5.75; 34 3.25,5.75; 35 2.75,5.75; 36 2.25,5.75; 37 1.75,5.75; 38 1.25,5.75; 39 0.75,5.75; 40 0.25,5.75; 41 -0.25,5.75; 42 -0.75,5.75; 43 -1.25,5.75; 44 -1.75,5.75; 45 -2.25,5.75; 46 -2.75,5.75; 47 -3.25,5.75; 48 -3.75,5.75 | smd 1.2 x 0.3: 17 5.75,-3.75; 18 5.75,-3.25; 19 5.75,-2.75; 20 5.75,-2.25; 21 5.75,-1.75; 22 5.75,-1.25; 23 5.75,-0.75; 24 5.75,-0.25; 25 5.75,0.25; 26 5.75,0.75; 27 5.75,1.25; 28 5.75,1.75; 29 5.75,2.25; 30 5.75,2.75; 31 5.75,3.25; 32 5.75,3.75; 49 -5.75,3.75; 50 -5.75,3.25; 51 -5.75,2.75; 52 -5.75,2.25; 53 -5.75,1.75; 54 -5.75,1.25; 55 -5.75,0.75; 56 -5.75,0.25; 57 -5.75,-0.25; 58 -5.75,-0.75; 59 -5.75,-1.25; 60 -5.75,-1.75; 61 -5.75,-2.25; 62 -5.75,-2.75; 63 -5.75,-3.25; 64 -5.75,-3.75
SMALL_MAVRIC_MICR0_USB = smd 1.35 x 0.4: 1 2.25,1.3; 2 2.25,0.65; 3 2.25,0; 4 2.25,-0.65; 5 2.25,-1.3 | smd 1.9 x 1.8: 8 -0.5,-1.15; 9 -0.5,1.15 | drill 1: P$1 -0.5,4.15; P$2 -0.5,-4.2 | drill 0.8: P$3 2.5,2.35; P$4 2.55,-2.4
SMALL_MAVRIC_SMALL_MAVRIC_SMALL_MAVRIC_LGA-8 = smd 0.35 x 0.35: P$1 -0.725,0.325; P$2 0.725,0.325; P$3 -0.725,-0.325; P$4 0.725,-0.325; P$5 -0.725,0.975; P$6 0.725,0.975; P$7 -0.725,-0.975; P$8 0.725,-0.975
SMALL_MAVRIC_SWITCH = smd 1.7 x 0.8: 1 0,2.1; 2 0,-2.1
SMALL_MAVRIC_POWER_PWSON = smd 0.3 x 0.5: P$1 -1,-1.325; P$2 -0.475,-1.325; P$3 0,-1.325; P$4 0.5,-1.325; P$5 1,-1.325; P$6 1,1.325; P$7 0.5,1.325; P$8 -0.025,1.325; P$9 -0.5,1.325; P$10 -1,1.325 | smd 2.286 x 1.524: P$11 0,0
SMALL_MAVRIC_SMALL_MAVRIC_SMALL_MAVRIC_INDUCTOR_4.3X4.3 = smd 0.98 x 3.4: P$1 -1.2,0; P$2 1.2,0
SMALL_MAVRIC_CONN_RAIL_X8 = drill 0.9 pad 1.676: P$1 -10.16,0; P$2 -7.62,0; P$3 -5.08,0; P$4 -2.54,0; P$5 0,0; P$6 2.54,0; P$7 5.08,0; P$8 7.62,0
SMALL_MAVRIC_SMALL_CONN = drill 0.9 pad 1.676: P$1 0,0
OSCILLATOR_ABM10 = smd 0.7 x 0.65: 1 -0.825,-0.625; 2 0.825,-0.625; 3 0.825,0.625; 4 -0.825,0.625

### Placement (x,y rotation side)
C1  21.19,10.37 0 top
C2  17.76,23.95 0 top
C3  20.41,8.95 0 top
C4  10.02,20.63 180 top
C5  23.21,17.95 0 top
C6  6.75,7.98 90 top
C7  9.78,23.72 270 top
C8  23.94,12.17 180 top
C9  23.83,15.51 0 top
C10  13.23,26.15 180 top
C11  9.78,25.9 0 top
C17  18.12,7.23 180 top
C21  19.58,26.2 270 bottom
C22  13.19,26.1 180 bottom
C23  18.91,22.69 270 bottom
C25  21.95,15.11 90 top
C28  20.09,16.6 270 bottom
C29  24.99,15.74 90 bottom
C30  18.49,15.56 90 bottom
C31  20.91,20.41 0 bottom
C32  27.59,10.57 90 bottom
C33  27.12,14.97 270 bottom
C34  21.49,3.34 180 bottom
C35  20.15,4.82 90 bottom
C36  21.24,7.85 90 bottom
C37  19.74,8 90 bottom
C38  18.24,7.9 90 bottom
C40  5.85,7.1 0 bottom
C41  12,5.5 270 bottom
C42  9.5,4.5 270 bottom
C54  9.37,9.27 270 top
D1  30.71,10.66 0 top
D2  30.71,9.39 0 top
D3  23.46,19.84 90 bottom
D4  24.31,13.56 180 bottom
D9  28.64,7.52 90 bottom
D10  6.43,18.45 270 top
L1  25.94,19.75 90 bottom
P5  28.77,19.54 180 top
P10  1.75,5 90 top
P11  1.75,25 90 top
P12  28.25,25 90 top
P13  28.25,5 90 top
Q1  5.5,4.75 90 top
Q2  5.5,25.75 90 top
Q3  25,25.5 270 top
Q4  25,6.25 270 top
Q5  21.47,23.15 90 bottom
R1  24.63,9.89 180 top
R2  13.52,23.49 270 top
R3  3.22,23.25 90 bottom
R4  7.92,17.38 270 top
R5  13.09,26.98 0 top
R6  10.79,26.97 0 top
R7  20.37,26.29 270 bottom
R8  6.45,21.22 90 top
R9  24.63,10.66 180 top
R11  17.11,4.41 90 top
R12  3.06,3.87 270 bottom
R13  20.09,14.37 180 bottom
R14  21.89,18.57 180 bottom
R15  21.83,5.41 270 bottom
R21  21.03,4.66 270 bottom
R22  19.89,20.59 180 top
R23  24.85,2.68 180 bottom
R24  27.05,6.31 0 bottom
U1  22.38,16.23 0 bottom
U2  16.5,24.3 180 bottom
U3  16.75,8 270 bottom
U4  15,4.5 180 bottom
U$1  15,15 90 top
U$2  1.94,14.94 0 top
U$4  11.55,23.85 270 bottom
U$5  1.41,25.14 180 bottom
U$6  1.45,5 0 bottom
U$8  24.19,5.09 270 bottom
U$9  24.38,9.15 0 bottom
U$10  13.51,28.71 180 top
U$11  16.07,1.23 0 top
U$15  28.71,15.37 0 top
U$16  28.71,13.08 0 top
Y1  23.9,13.86 0 top

### Tracks (layer width: path | path; a pad name or v marks a point on that pad's centre or on a via)
3.3V  (via drill 0.2)
  Top 0.2: C4.1 10.64,20.75 U$1.32 10.9,21.1 v10.9,21.7 | v14.6,26.3 14.3,25.9 v14.3,23.7 14.3,22.75 15.3,21.75 v15.5,21.75 | 17.26,22.53 17.26,22.34 17.7,21.9 17.7,20.75 U$1.19 17.8,20.7 v17.8,19.7 v17.8,13.1 | 17.26,22.53 C2.1 | 17.26,22.53 17.43,22.7 v19.6,22.7 19.7,22.7 20.1,21.98 20.09,21.49 R22.1 | v22.1,6.6 22.2,6.3 22.2,2.5 23.47,1.23 U$11.P$8 | v10.4,13.2 10.4,11.2 9.3,11.2 U$1.48 9.37,11.13 C54.1 9.15,9.9 8.4,9.9 8.1,9.6 v8.1,8.8 | v19,6.3 19,7.2 C17.1 18.75,7.45 U$1.64 19.05,8.95 C3.1 19.91,9.59 C1.1 20.69,11.19 U$1.1 19.45,11.25 19,11.3 v19,13
  Bottom 0.2: U$4.P$6 10.57,21.93 v10.9,21.7 15.45,21.7 v15.5,21.75 | U2.1 14.3,23.3 v14.3,23.7 | U2.8 15.9,26.2 15.76,26.31 | 15.76,26.31 15.5,26.5 15.1,26.5 14.9,26.3 v14.6,26.3 14.4,26.1 C22.2 | U2.10 16.7,26.5 15.95,26.5 15.76,26.31 | U2.22 16.3,22.2 15.8,21.75 v15.5,21.75 | Q5.2 19.6,23.33 v19.6,22.7 19.6,22.2 19.49,22.19 C23.2 | v15.5,21.75 15.5,19.7 v17.8,19.7 | R23.1 23.69,2.02 U$11.P$8 | U$8.P$9 22.86,5.6 22.4,5.6 22.09,5.91 R15.1 22.1,6.18 v22.1,6.6 21.7,7 C36.1 21.09,7.15 C37.1 19.64,7.05 19,7.05 | U3.4 5.96,13.64 6.3,13.3 10.4,13.3 v10.4,13.2 10.6,13.1 v17.8,13.1 18.3,13.1 18.9,13.1 v19,13 | 19,7.05 C38.1 17.3,6.11 17.3,5.9 17.2,5.8 U4.3 | v19,6.3 19,7.05 | v8.1,8.8 8,8.7 8,7.5 7.6,7.1 C40.1 5.8,6.2 4.2,6.2 4.2,6.9 4.1,7 1.55,7 U$6.1
3V3_ANA  (via drill 0.2)
  Top 0.15: v12.3,23.65 12.3,25.3 12.1,25.5 12.1,27.5 v12.4,27.7 | C5.1 22.65,17.95 22,17.3 20.8,17.3 U$1.13 20.7,17.3 19.9,17.3 19.6,17.6 v19.2,17.6 | C5.1 22.7,18.26 | v22.8,25.2 22.6,25 22.6,18.6 22.71,18.49 C5.1 | v14.6,17.4 v14.6,10.7 | v10.7,9 10.6,8.9 v10.6,4.2
  Bottom 0.15: U$4.P$8 12.53,23.48 v12.3,23.65 | U2.13 18,26.3 | v12.4,27.7 12.6,27.6 17.5,27.6 18,27 18,26.3 | 18,26.3 19.48,25.9 C21.2 19.58,25.28 19.7,25.2 v22.8,25.2 | U4.5 13.7,2.85 10.6,2.85 | 10.6,2.85 C42.2 | v19.2,17.6 19,17.4 v14.6,17.4 | v14.6,10.7 14.7,10.6 11.7,10.6 11.6,10.5 11.6,9.9 v10.7,9 | v10.6,4.2 10.6,2.85
6V_ENABLE1
  Bottom 0.15: R14.1 21.43,18.53 U1.4 20.52,17.53 C28.1
+5V  (via drill 0.2)
  Top 0.2: v25.7,14.4 25.6,14.5 25.6,15.3 25,15.9 v25,19.3
  Bottom 0.2: C30.1 18.83,14.37 R13.1 19.59,13.61 19.6,13.6 21.1,13.6 21.9,12.8 25.3,12.8 25.4,12.9 25.4,13.5 D4.2 25.7,13.8 v25.7,14.4 | v25,19.3 25.94,20.24 L1.2
ADC1_IN5
  Top 0.15: U$1.21 16.75,26.87 U$10.P$3
ADC1_IN6
  Top 0.15: U$1.22 16.25,28.51 U$10.P$4
CAN2_RX
  Top 0.15: U$1.33 9,19 9,20.6 8.6,21 8.6,24.3 8.43,24.47 U$10.P$7
CAN2_TX
  Top 0.15: U$1.34 9.2,18.3 8.4,18.3 8.4,20.4 8.2,20.7 8.2,23.8 7.9,24.1 7.9,27.3 6.49,28.71 U$10.P$8
GND  (via drill 0.2)
  Top 0.2: R2.1 13.52,24.58 v13.5,24.6 13.73,24.83 C10.1 13.73,26.23 v14.5,26.9 | v18.5,26.8 v17.5,26.8 | C2.2 18.75,23.95 v18.9,23.9 | U$1.18 18.2,20.75 v18.2,22.2 | C9.1 23.23,15.61 | C9.1 23.33,14.74 Y1.4 23.09,14.5 v24,14.5 | Y1.2 24.44,12.95 C8.1 24.5,12.11 v24.5,11.5 | Y1.2 24.79,13.2 v27.1,13.2 | v21.9,11.4 21.69,11.19 C1.2 21.69,9.73 C3.2 21,9.04 v21,9.6 | v22.4,16.2 21.85,16.75 U$1.12 19.6,16.8 v19.3,16.9 | C25.2 22.4,16.06 v22.4,16.2 | v22.4,16.2 23.71,17.51 C5.2 23.5,18.16 v23.5,20.1 | C9.1 22.64,16.2 v22.4,16.2 | D2.C D1.C 27.6,11.78 v27.6,12.2 | v24,13.3 24.07,13.23 Y1.2 | v21.8,24.2 v21.8,22 | v25,24.3 24.75,24.55 Q3.2 | Q4.2 24.2,5 v24.2,3.5 | U$1.63 18.3,9.3 v18.3,10.3 | v17.3,8.2 17.27,8.17 C17.2 19.3,5.2 v19.3,4.3 | C4.2 9,21.15 9,23.7 9.1,23.8 v9.9,23.8 9.78,24.02 C7.1 9.78,25.4 C11.1 9.28,26.52 v9.2,26.6 | v4.2,26.7 Q2.2 6.7,26.6 v6.7,25.8 | U$2.5 4.05,13.5 3.6,13.5 3.5,13.4 3.5,11.6 3.7,11.4 v4.6,11.4 | C54.2 8.08,7.13 | 8.08,7.13 C6.1 6.6,6.98 Q1.2 5.6,5.7 v5.5,5.6 | v5.8,7.1 5.5,6.8 v5.5,5.6 | 8.08,7.13 v8.4,6.81 v8.4,6.8 | v5.5,5.6 5.6,5.5 5.6,2.2 5.91,1.89 U$11.P$1
  Bottom 0.2: v9.9,23.8 11.1,23.9 11.2,24.15 | 11.2,24.15 11.2,24.55 U$4.P$1 | 11.2,24.15 12.4,24.15 12.53,24.32 U$4.P$7 12.55,24.6 v13.5,24.6 | C22.1 13.59,26.9 v14.5,26.9 16.8,26.9 17.1,26.6 | 18,22.2 17.1,22.2 U2.20 17.1,23.7 U2.CENTRAL_PAD 17.1,24.9 U2.11 17.1,26.6 | 18,22.2 U2.18 18.8,23.3 C23.1 18.9,23.3 v18.9,23.9 19.8,24.8 21.4,24.8 21.9,24.3 | v17.5,26.8 17.1,26.6 | 18,22.2 v18.2,22.2 | v18.5,26.8 C21.1 19.77,26.79 R7.1 | C28.2 19.78,16.41 19.33,16.41 | 19.33,16.41 C30.2 17.83,15.75 U3.CD2 | v24.5,11.5 24.4,11.4 v21.9,11.4 | U1.2 22.4,14.95 v22.4,16.2 | 19.33,16.41 19.3,16.44 v19.3,16.9 | C32.2 27.59,12.09 v27.6,12.2 27.6,12.7 v27.1,13.2 27.12,13.42 C33.2 27.86,14.12 U$15.P$1 28.71,16.29 27.8,17.1 27.8,19.5 28.73,19.5 P5.P$2 | v23.5,20.1 23.46,20.14 D3.2 22.34,20.99 C31.1 21.76,21.16 v21.8,22 | v24,14.5 v24,13.3 | 21.9,24.3 v21.8,24.2 | 21.9,24.3 22,24.4 23.3,24.4 23.4,24.3 v25,24.3 | U$8.P$4 25.5,4.6 24.5,4.6 24.19,4.91 U$8.P$11 | U$8.P$11 23.7,4.6 U$8.P$7 22.49,4.59 22.2,4.3 21.17,4.3 R21.2 | v24.2,3.5 24.19,3.61 U$8.P$11 | R21.2 20.31,4.16 C35.1 19.32,4.32 v19.3,4.3 15.6,4.3 15,4.9 U4.2 15,7.4 12.5,7.4 12,6.5 C41.1 11,5.45 C42.1 9.5,5.7 v8.4,6.8 | R21.2 20.99,4.12 C34.1 | v21,9.6 21.24,9.26 C36.2 21.09,8.85 C37.2 19.64,8.75 C38.2 | v18.3,10.3 18.24,10.24 C38.2 | C38.2 17.79,8.3 17.3,8.3 v17.3,8.2 | U3.GND1 2.2,21.73 R3.1 3.37,22.9 4.2,22.9 v4.2,26.7 | U3.6 4.64,11.44 v4.6,11.4 4.6,9.85 U3.GND3 4.15,7.5 C40.2 v5.8,7.1 | R12.1 4.29,5.6 v5.5,5.6 | v6.7,25.8 9.18,25.8 9.2,25.98 v9.2,26.6
  other vias: 17.1,18.2 14.6,4.4 15.1,2.9 17.3,1.7 22.4,0.6 7.2,29.3 12.2,29.3 17.3,29.3 14,19.5 9.7,0.7 12.3,0.8 14.8,0.8 14.8,29.3 0.9,5 13.1,11.3
  pour Bottom: -0.7,30.6 30.7,30.6 30.7,-0.7 -0.7,-0.7
  pour Top: -1.2,31.1 31.4,31.1 31.4,-1.3 -1.2,-1.3 -1.2,31
I2C2_SCL  (via drill 0.2)
  Top 0.15: v11.7,23.65 11.7,25.4 11.8,25.6 11.8,27.9 12.1,28.2 13,28.2 U$10.P$5 13.59,28.63 R5.2
  Bottom 0.15: U2.23 15.9,22.3 15.8,22.2 12.3,22.2 11.88,22.93 U$4.P$4 11.78,23.18 v11.7,23.65
I2C2_SD
  Top 0.15: U$1.30 12.25,22.15 11.6,22.8 11.2,22.8 10.8,23.2 10.8,25.88 C11.2 R6.1
I2C2_SDA  (via drill 0.2)
  Top 0.15: v11.3,25.9 11.3,26.86 R6.2 11.29,28.39 U$10.P$6
  Bottom 0.15: v11.3,25.9 11.3,25.1 11.7,25.1 | U2.24 14.2,22.8 13.6,23.4 13.6,24 13.8,24 14.2,24.4 14.2,24.7 13.7,25.1 11.7,25.1 | U$4.P$3 11.88,24.93 11.7,25.1
N$1
  Top 0.15: R1.1 25.63,9.39 D2.A
N$2
  Top 0.15: D10.1 6.45,19.62 R8.1
N$3
  Top 0.15: C8.2 23.44,12.87 Y1.1 20.77,13.23 U$1.5
N$4
  Top 0.15: U$1.28 13.25,22.72 R2.2
N$5
  Top 0.15: U$1.31 11.75,21.95 11.5,22.2 10.45,22.2 C7.2
N$6
  Top 0.15: U$1.47 7.85,11.75 6.7,10.6 6.7,8.88 C6.2
N$7
  Top 0.15: C9.2 24.73,15.12 Y1.3 24.73,14.32 24.3,13.9 21.9,13.9 21.8,13.8 20.8,13.8 U$1.6
N$8
  Top 0.15: U$1.42 8.45,14.25 8.1,14.6 8.1,16.7 R4.2
N$9
  Bottom 0.15: R3.2 2.87,23.4 1.9,23.4 1.54,23.04 U$5.1
N$10
  Top 0.2: Q2.3 3.88,26.27 P11.-
N$11  (via drill 0.3)
  Top 0.4: v25.7,16.2 25.9,16.6 v25.9,19.3
  Bottom 0.4: D3.1 23.33,18.56 U1.6 23.4,17.06 23.4,17 23.46,16.34 C29.2 25.05,16.2 v25.7,16.2 | v25.9,19.3 25.94,19.26 L1.1
N$12
  Top 0.2: Q3.3 26.87,26.27 P12.-
N$13
  Top 0.15: R9.1 D1.A
N$14  (via drill 0.2)
  Top 0.2: v19.5,15.2 18.7,15.2 18.7,18.5 19.3,19.2 20.9,19.2 21.3,19.6 21.3,21.3 20.9,21.7 20.9,25.6 v21.1,25.8
  Bottom 0.2: U1.3 21.15,14.93 R13.2 20.59,14.71 20.4,15 19.8,15 v19.5,15.2 | R7.2 20.58,25.8 v21.1,25.8
N$15
  Bottom 0.15: D4.1 23.16,14.76 U1.1 23.64,15.24 C29.1
N$16
  Bottom 0.15: U$9.P$1 25.52,9.09 U$8.P$1
N$17
  Top 0.2: U$1.3 20.8,12.3 21.9,12.3 22.4,11.8 22.4,11.1 23.61,9.89 R1.2
N$18
  Bottom 0.15: U$9.P$2 23,8.97 23,8.9 22.86,8.77 U$8.P$10
N$19
  Bottom 0.15: U$8.P$6 22.11,3.34 C34.2
N$22
  Top 0.2: P10.- 3.27,4.75 Q1.3
N$24
  Top 0.2: U$1.4 20.8,12.8 22.1,12.8 22.8,12.1 22.8,11.3 23.44,10.66 R9.2
N$25  (via drill 0.2)
  Top 0.15: C25.1 21.95,14.55 21.6,14.2 20.8,14.2 U$1.7 20.7,14.2 19.1,14.2 v19,13.7 | v14.1,13.7 14,13.8 v14,18.8 | v7.4,19.4 v7.4,22.5
  Bottom 0.15: v19,13.7 v14.1,13.7 | v14,18.8 13.4,19.4 v7.4,19.4 | v7.4,22.5 7.1,23.1 5.3,23.1 5.2,23.2 5.2,27.2 5.16,27.24 U$5.2
N$26
  Top 0.2: P13.- 28.23,6.25 Q4.3
N$27
  Top 0.15: U$1.60 16.8,9.2 16.8,8.1 16.7,8 16.5,8 16.5,6.6 17.11,5.99 R11.2
N$28
  Top 0.15: U$1.29 12.75,26.13 C10.2 12.73,27.02 R5.1
N$29  (via drill 0.2)
  Top 0.15: R11.1 17.52,3.5 v17.7,3.4
  Bottom 0.15: v17.7,3.4 17.7,2.3 9.1,2.3 8.8,2.6 5.3,2.6 4.53,3.37 R12.2 2.59,2.9 U$6.2
N$31
  Bottom 0.15: U$8.P$8 22.85,5.1 22.4,5.1 22.11,4.81 R15.2 21.58,5.16 R21.1 20.87,5.32 C35.2
N$32
  Bottom 0.4: D9.2 28.71,8.74 U$16.P$1
N$33
  Bottom 0.15: R24.1 27.61,6.37 D9.1
N$34
  Bottom 0.4: Q5.3 23.12,22.6 27.7,22.6 28.77,21.53 P5.P$3
PG
  Bottom 0.15: U$8.P$5 25.35,3.92 R23.2
SD_DETECT  (via drill 0.2)
  Top 0.15: v11.8,11.8 11.8,9.8 11.75,9.75 U$1.50
  Bottom 0.15: U3.CD1 16.3,10.1 16.3,12 14.6,12 14.4,11.8 v11.8,11.8
SDIO_CK  (via drill 0.2)
  Top 0.15: U$1.53 13.55,11.25 v13.6,12.4
  Bottom 0.15: v13.6,12.4 7.9,12.4 7.8,12.3 6.29,12.3 U3.5
SDIO_CMD  (via drill 0.2)
  Top 0.15: U$1.54 13.75,10.55 14.1,12.1 14.1,12.8 13.4,13.5 v13.4,14.8
  Bottom 0.15: U3.3 13.34,14.74 v13.4,14.8
SDIO_D0  (via drill 0.2)
  Top 0.15: U$1.39 10.45,15.75 11.3,15.2 v11.3,11.2
  Bottom 0.15: v11.3,11.2 7.8,11.2 6.9,10.3 6.09,10.3 U3.7
SDIO_D1  (via drill 0.2)
  Top 0.15: U$1.40 10.15,15.25 10.9,14.9 v10.8,10.6
  Bottom 0.15: v10.8,10.6 8.2,10.6 6.8,9.2 6.09,9.2 U3.8
SDIO_D2  (via drill 0.2)
  Top 0.15: U$1.51 12.25,16.85 v12.2,16.9
  Bottom 0.15: v12.2,16.9 6.09,16.9 U3.1
SDIO_D3  (via drill 0.2)
  Top 0.15: U$1.52 12.7,9.3 12.7,10.6 12.6,10.7 12.6,15.5 12.9,15.8 v13,15.8
  Bottom 0.15: v13,15.8 9.4,15.8 8.6,16.6 7.21,16.6 U3.2
SW_RECEIVER  (via drill 0.2)
  Top 0.15: v19.6,21.7 19.49,21.2 R22.2 | U$1.20 17.2,20.8 v17.2,21.7
  Bottom 0.15: Q5.1 20.2,22.2 v19.6,21.7 v17.2,21.7
TIM2_CH2  (via drill 0.2)
  Top 0.15: U$1.55 14.2,9.2 14.2,8.6 v13.6,8 | v9.7,7.2 6.6,4.1 Q1.1 8.45,1.95 U$11.P$2
  Bottom 0.15: v13.6,8 9.7,8 v9.7,7.2
TIM3_CH1  (via drill 0.2)
  Top 0.15: U$11.P$3 10.99,1.59 14.9,5.5 14.9,8.2 14.8,8.3 14.8,9.2 U$1.56 14.8,9.3 14.8,10.1 16.1,11.4 16.1,18.7 15.8,19 v15,19 | v7.9,20 7.8,20.1 7.8,22 7.9,22.1 7.9,22.9 6.6,24.2 Q2.1
  Bottom 0.15: v15,19 14.5,19.5 14.5,19.7 14.2,20 v7.9,20
TIM3_CH2
  Top 0.15: U$1.57 15.2,9.2 15.2,3.8 13.53,2.13 U$11.P$4
TIM4_CH1  (via drill 0.2)
  Top 0.15: U$11.P$5 16.07,1.93 15.8,2.2 15.8,9.2 U$1.58 15.8,9.3 15.8,10.3 17.7,12.2 18.4,12.2 18.3,12.3 18.3,18.7 19.2,19.6 20.7,19.6 20.9,19.8 20.9,21.1 20.5,21.5 20.5,26.7 v21.1,26.7 | v22.8,26.7 23.05,26.45 Q3.1
  Bottom 0.15: v21.1,26.7 v22.8,26.7
TIM4_CH2
  Top 0.15: U$1.59 16.2,9.2 16.2,6.1 16.5,5.8 16.5,3.5 18.61,1.39 U$11.P$6
TIM4_CH3  (via drill 0.2)
  Top 0.15: v22.2,9.6 22.2,8.9 Q4.1 23.8,7.3 21.5,7.3 21.15,6.95 U$11.P$7 | U$1.61 17.3,10.1 v17.5,10.9
  Bottom 0.15: v22.2,9.6 20.9,10.9 v17.5,10.9
UART4_RX
  Top 0.15: U$1.15 20.8,18.3 21.7,18.3 21.7,21.5 21.3,21.8 21.3,25.2 21.6,25.6 21.6,27.4 21.13,27.87 U$10.P$2
UART4_TX
  Top 0.15: U$1.14 20.8,17.8 21.9,17.8 22.3,18.8 22.3,27.6 23.31,28.71 U$10.P$1
USART2_RX  (via drill 0.2)
  Top 0.15: U$1.17 18.8,20.7 v18.7,19.8 | v23.1,21.8 23.2,21.7 23.2,21.1 23.7,20.6 26.7,20.6 27.8,19.5 27.8,18.1 27.86,18.04 P5.P$1
  Bottom 0.15: v18.7,19.8 18.7,21.2 20.7,21.2 21,21.5 21.3,21.5 21.3,22.5 22.6,22.5 v23.1,21.8
USB_OTG_FS_DM
  Top 0.15: U$1.44 8.15,13.25 7.8,13.6 7.8,15.4 7.6,15.6 U$2.2
USB_OTG_FS_DP
  Top 0.15: U$1.45 7.95,12.75 7.5,13.2 7.5,14.9 4.23,14.9 U$2.3
USB_OTG_FS_ID  (via drill 0.2)
  Top 0.15: 5.75,14.25 5.7,14.25 | 5.7,14.25 4.25,14.25 U$2.4 | U$1.43 8.35,13.75 v8.3,13.8 | v7,13.8 6.7,13.8 6.3,14.2 5.75,14.2 5.7,14.25
  Bottom 0.15: v8.3,13.8 v7,13.8
USB_OTG_VBUS
  Top 0.2: R4.1 7.34,17.3 D10.2 5.37,16.24 U$2.1
VBAT  (via drill 0.3)
  Top 0.4: v23.8,21.8 23.8,23.3 27,23.3 27.43,23.73 P12.+ | P13.+ 27.18,4.8 v26.6,4.8 | v14.1,6.8 14.4,7 v14.4,8 | v15.3,11.4 15.5,11.6 v15.5,18.1 | R8.2 4.48,21.72 v4.3,21.9 3.58,21.9 P11.+ | v11.4,3.4 11.3,3.5 8.3,3.5 8.2,3.6 v8.2,3.7 | v5,3.7 4.83,3.73 P10.+
  Bottom 0.2: 26,5.6 25.96,5.57
  Bottom 0.3: 25.96,5.57 U$8.P$2 U$8.P$3
  Bottom 0.4: U1.5 22.36,18.55 R14.2 22.3,18.66 22.3,19.1 | 22.3,19.1 21.9,19.5 20.3,19.5 20.06,19.74 | 20.06,19.74 C31.2 | 22.3,19.1 22.6,19.4 24.3,19.4 | 24.3,19.4 24.3,17 24.4,16.9 26.5,16.9 27.12,16.88 C33.1 27,15.7 26.3,15.7 26.3,12.8 26.7,12.4 26.7,9.8 26.78,9.72 C32.1 26.55,8.68 R24.2 26.5,6.26 26.5,5.6 | 24.3,19.4 24.3,21.8 v23.8,21.8 | 26.5,5.6 26,5.6 | v26.6,4.8 26.5,4.9 26.5,5.6 | v14.1,6.8 14.05,6.1 U4.1 13.45,5.2 13.3,5.2 12.65,4.55 C41.2 11.4,3.95 v11.4,3.4 | v14.4,8 15.3,8.8 v15.3,11.4 | 20.06,19.74 20.06,19.56 19.6,19.1 16,19.1 v15.5,18.1 15.4,18.2 5.7,18.2 4.3,19.6 v4.3,21.9 | v8.2,3.7 8.1,3.8 v5,3.7

### Text on the board
bPlace: SMALL_MAVRIC | V2.0 | EPFL_LIS | GREG_HEITZ